# EAGLE schematic countercat_rev2 (EAGLE 6.5.0)
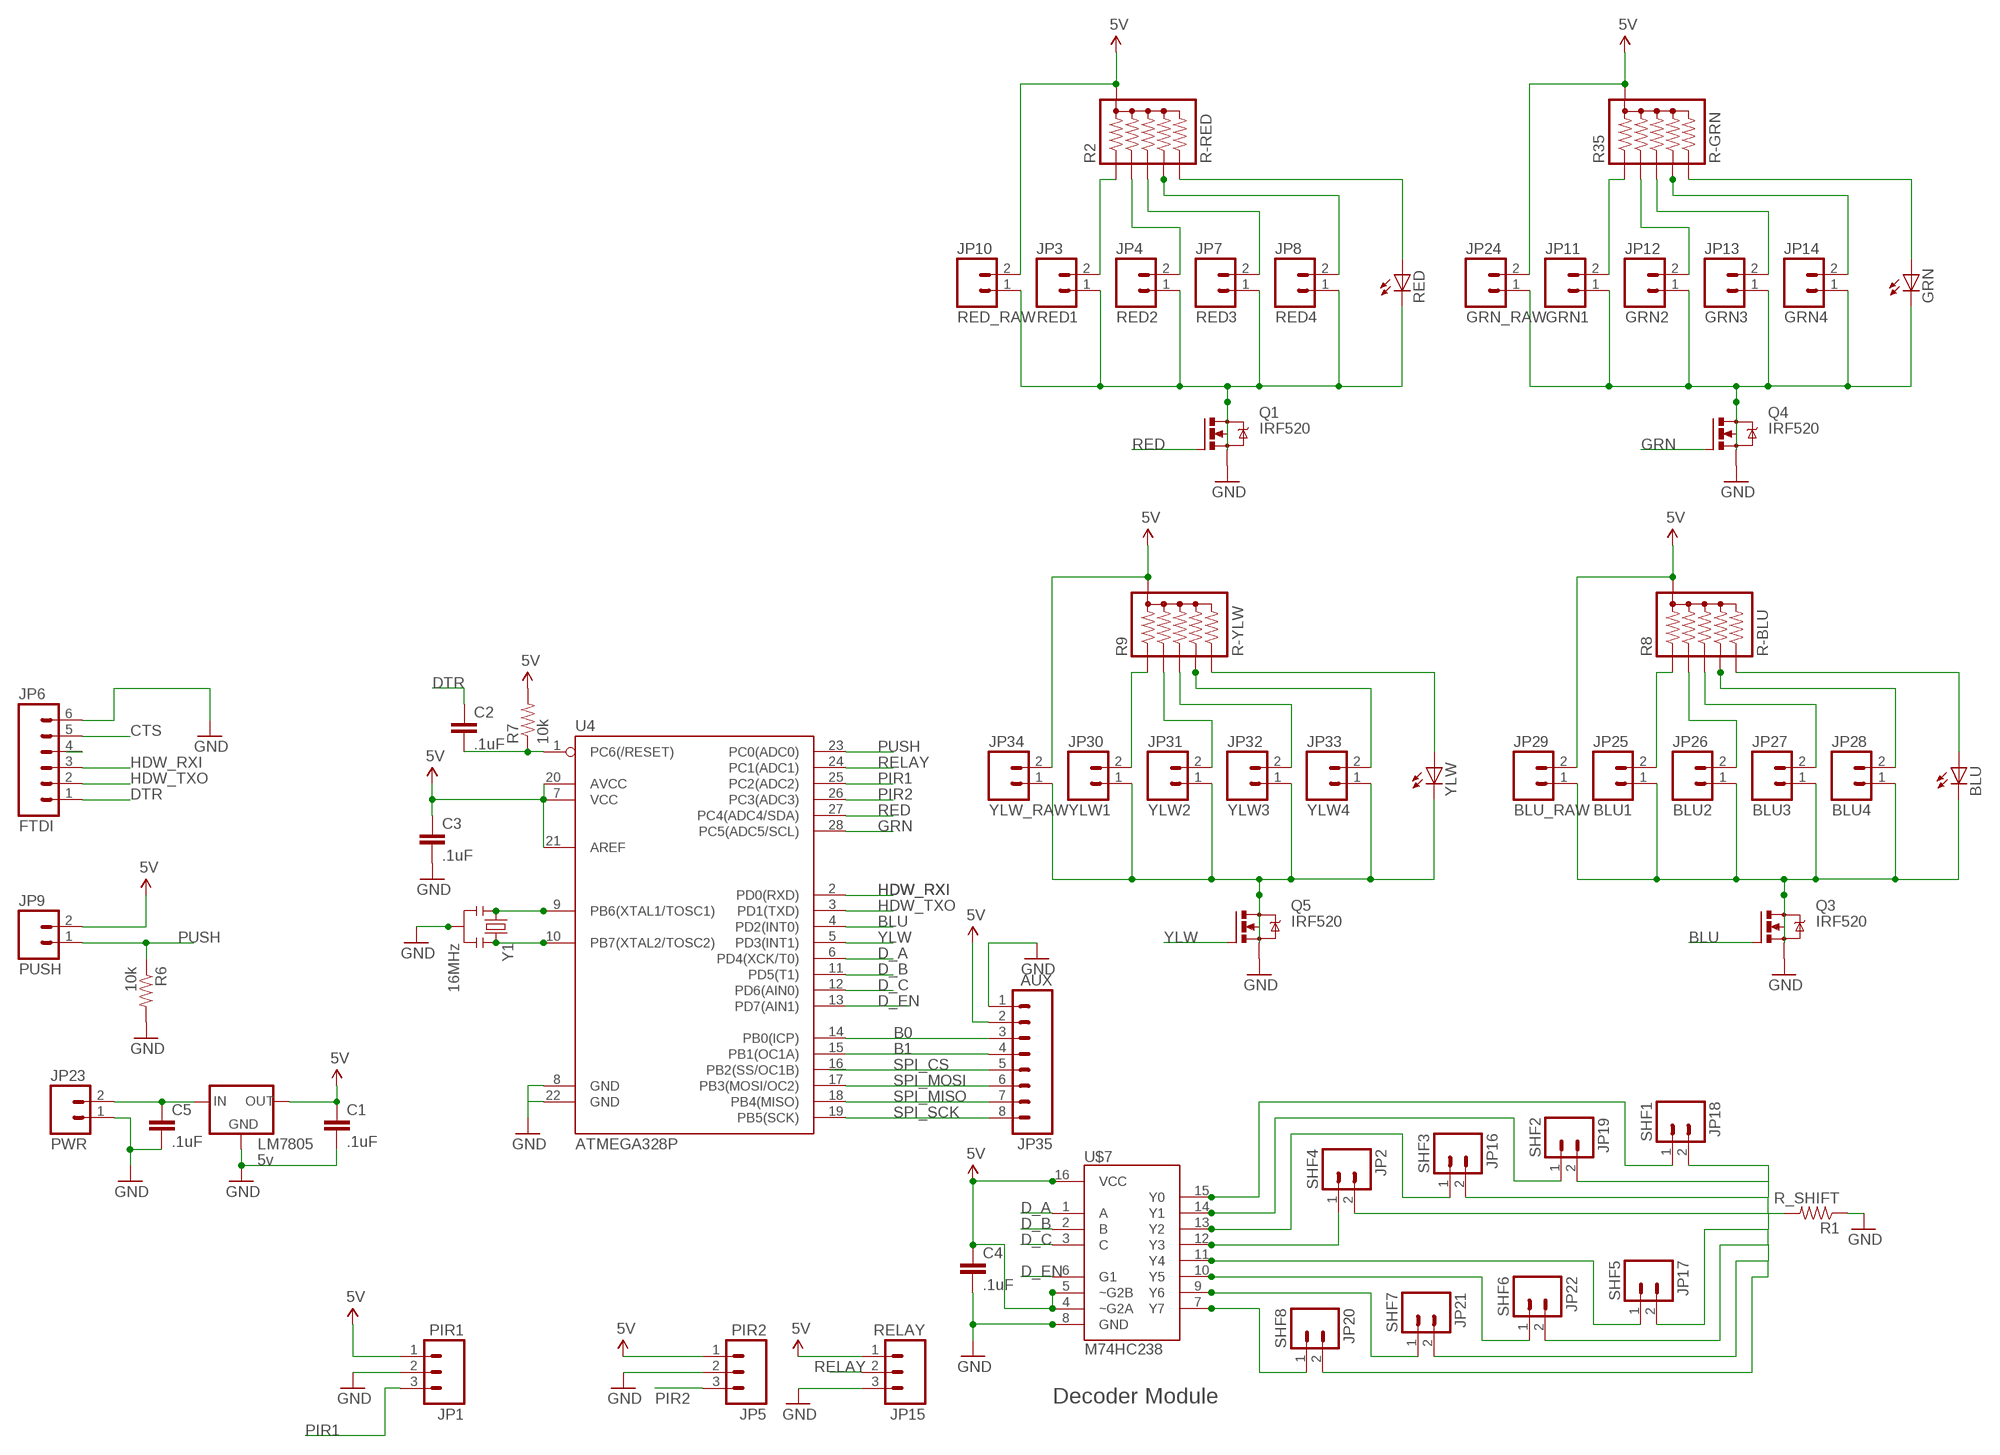
[diagram p0: schematic, sheet 1]

## Parts
BLU  LED3MM  [LED3MM]
C1  .1uF  CAPPTH2  [CAP-PTH-SMALL2]
C2  .1uF  CAPPTH2  [CAP-PTH-SMALL2]
C3  .1uF  CAPPTH2  [CAP-PTH-SMALL2]
C4  .1uF  CAPPTH2  [CAP-PTH-SMALL2]
C5  .1uF  CAPPTH2  [CAP-PTH-SMALL2]
GRN  LED3MM  [LED3MM]
JP1  PIR1  M03POLAR  [MOLEX-1X3]
JP2  SHF4  M02POLAR  [MOLEX-1X2]
JP3  RED1  M02POLAR  [MOLEX-1X2]
JP4  RED2  M02POLAR  [MOLEX-1X2]
JP5  PIR2  M03POLAR  [MOLEX-1X3]
JP6  FTDI  M06LOCK  [1X06_LOCK]
JP7  RED3  M02POLAR  [MOLEX-1X2]
JP8  RED4  M02POLAR  [MOLEX-1X2]
JP9  PUSH  M02POLAR  [MOLEX-1X2]
JP10  RED_RAW  M02POLAR  [MOLEX-1X2]
JP11  GRN1  M02POLAR  [MOLEX-1X2]
JP12  GRN2  M02POLAR  [MOLEX-1X2]
JP13  GRN3  M02POLAR  [MOLEX-1X2]
JP14  GRN4  M02POLAR  [MOLEX-1X2]
JP15  RELAY  M03POLAR  [MOLEX-1X3]
JP16  SHF3  M02POLAR  [MOLEX-1X2]
JP17  SHF5  M02POLAR  [MOLEX-1X2]
JP18  SHF1  M02POLAR  [MOLEX-1X2]
JP19  SHF2  M02POLAR  [MOLEX-1X2]
JP20  SHF8  M02POLAR  [MOLEX-1X2]
JP21  SHF7  M02POLAR  [MOLEX-1X2]
JP22  SHF6  M02POLAR  [MOLEX-1X2]
JP23  PWR  M02POLAR  [MOLEX-1X2]
JP24  GRN_RAW  M02POLAR  [MOLEX-1X2]
JP25  BLU1  M02POLAR  [MOLEX-1X2]
JP26  BLU2  M02POLAR  [MOLEX-1X2]
JP27  BLU3  M02POLAR  [MOLEX-1X2]
JP28  BLU4  M02POLAR  [MOLEX-1X2]
JP29  BLU_RAW  M02POLAR  [MOLEX-1X2]
JP30  YLW1  M02POLAR  [MOLEX-1X2]
JP31  YLW2  M02POLAR  [MOLEX-1X2]
JP32  YLW3  M02POLAR  [MOLEX-1X2]
JP33  YLW4  M02POLAR  [MOLEX-1X2]
JP34  YLW_RAW  M02POLAR  [MOLEX-1X2]
JP35  AUX  M08LOCK  [1X08_LOCK]
LM7805  5v  V_REG_78XXSINK  [TO220-IGO]
Q1  IRF520  [TO220BV]
Q3  IRF520  [TO220BV]
Q4  IRF520  [TO220BV]
Q5  IRF520  [TO220BV]
R1  R_SHIFT  RESISTORPTH-1/4W  [AXIAL-0.4]
R2  R-RED  RPACK-BUSSED-5-SIP-PTH-5  [RPACK-SIP-PTH-5]
R6  10k  RESISTORPTH-1/4W  [AXIAL-0.4]
R7  10k  RESISTORPTH-1/4W  [AXIAL-0.4]
R8  R-BLU  RPACK-BUSSED-5-SIP-PTH-5  [RPACK-SIP-PTH-5]
R9  R-YLW  RPACK-BUSSED-5-SIP-PTH-5  [RPACK-SIP-PTH-5]
R35  R-GRN  RPACK-BUSSED-5-SIP-PTH-5  [RPACK-SIP-PTH-5]
RED  LED3MM  [LED3MM]
U4  ATMEGA328P  ATMEGA328P_PDIP  [DIL28-3]
U$7  M74HC238  [DIL16]
Y1  16MHz  RESONATORPTH  [RESONATOR-PTH]
YLW  LED3MM  [LED3MM]

## Nets
5V: C1.1 C4.1 JP1.1 JP5.1 JP9.2 JP10.2 JP15.1 JP24.2 JP29.2 JP34.2 JP35.2 LM7805.OUT R2.P$1 R7.P$2 R8.P$1 R9.P$1 R35.P$1 U$7.4(~G2A) U$7.5(~G2B) U$7.16(VCC)
B0: JP35.3 U4.14(PB0(ICP))
B1: JP35.4 U4.15(PB1(OC1A))
BLU: Q3.G U4.4(PD2(INT0))
CTS: JP6.5
D_A: U4.6(PD4(XCK/T0)) U$7.1(A)
D_B: U4.11(PD5(T1)) U$7.2(B)
D_C: U4.12(PD6(AIN0)) U$7.3(C)
D_EN: U4.13(PD7(AIN1)) U$7.6(G1)
DTR: C2.1 C2.2 JP6.1 R7.P$1 U4.1(PC6(/RESET))
GND: C1.2 C3.2 C4.2 C5.2 JP1.2 JP5.2 JP6.6 JP15.3 JP23.1 JP35.1 LM7805.GND Q1.S Q3.S Q4.S Q5.S R1.P$1 R6.P$2 U4.8(GND) U4.22(GND) U$7.8(GND) Y1.2
GRN: Q4.G U4.28(PC5(ADC5/SCL))
HDW_RXI: JP6.3 U4.2(PD0(RXD))
HDW_TXO: JP6.2 U4.3(PD1(TXD))
N$1: JP17.1 U$7.11(Y4)
N$2: JP3.1 JP4.1 JP7.1 JP8.1 JP10.1 Q1.D RED.K(C)
N$3: U4.9(PB6(XTAL1/TOSC1)) Y1.1
N$4: GRN.K(C) JP11.1 JP12.1 JP13.1 JP14.1 JP24.1 Q4.D
N$5: JP11.2 R35.P$2
N$7: U4.10(PB7(XTAL2/TOSC2)) Y1.3
N$8: C3.1 U4.7(VCC) U4.20(AVCC) U4.21(AREF)
N$12: JP4.2 R2.P$3
N$13: JP12.2 R35.P$3
N$15: JP13.2 R35.P$4
N$16: JP14.2 R35.P$5
N$18: JP7.2 R2.P$4
N$19: JP8.2 R2.P$5
N$21: R2.P$6 RED.A
N$22: JP3.2 R2.P$2
N$25: JP2.2 JP16.2 JP17.2 JP18.2 JP19.2 JP20.2 JP21.2 JP22.2 R1.P$2
N$26: JP18.1 U$7.15(Y0)
N$27: JP19.1 U$7.14(Y1)
N$28: JP16.1 U$7.13(Y2)
N$29: JP2.1 U$7.12(Y3)
N$30: JP21.1 U$7.9(Y6)
N$31: JP22.1 U$7.10(Y5)
N$32: JP20.1 U$7.7(Y7)
N$33: JP6.4
N$34: BLU.K(C) JP25.1 JP26.1 JP27.1 JP28.1 JP29.1 Q3.D
N$35: JP26.2 R8.P$3
N$36: JP27.2 R8.P$4
N$37: JP28.2 R8.P$5
N$38: BLU.A R8.P$6
N$39: JP25.2 R8.P$2
N$40: JP30.1 JP31.1 JP32.1 JP33.1 JP34.1 Q5.D YLW.K(C)
N$41: JP31.2 R9.P$3
N$42: JP32.2 R9.P$4
N$43: JP33.2 R9.P$5
N$44: R9.P$6 YLW.A
N$45: GRN.A R35.P$6
N$46: JP30.2 R9.P$2
PIR1: JP1.3 U4.25(PC2(ADC2))
PIR2: JP5.3 U4.26(PC3(ADC3))
PUSH: JP9.1 R6.P$1 U4.23(PC0(ADC0))
RED: Q1.G U4.27(PC4(ADC4/SDA))
RELAY: JP15.2 U4.24(PC1(ADC1))
SPI_CS: JP35.5 U4.16(PB2(SS/OC1B))
SPI_MISO: JP35.7 U4.18(PB4(MISO))
SPI_MOSI: JP35.6 U4.17(PB3(MOSI/OC2))
SPI_SCK: JP35.8 U4.19(PB5(SCK))
VB: C5.1 JP23.2 LM7805.IN
YLW: Q5.G U4.5(PD3(INT1))

## Notes on the sheet
- Decoder Module

## Library data of the parts
BLU GRN RED YLW = SparkFun-LED:LED: LEDs Standard schematic elements and footprints for 5mm, 3mm, 1206, and 0603 sized LEDs. 5mm - Spark Fun Electronics SKU : COM-00529 (and others)
C1-C5 = SparkFun-Capacitors:CAP: Capacitor Standard 0603 ceramic capacitor, and 0.1" leaded capacitor.
JP1 JP5 JP15 = SparkFun:M03: Header 3 Standard 3-pin 0.1" header. Use with straight break away headers (SKU : PRT-00116), right angle break away headers (PRT-00553), swiss pins (PRT-00743), machine pins (PRT-00117), and female headers (PRT-00115). Molex polarized connector foot print use with SKU : PRT-08232 with associated crimp pins and housings.
JP2-JP4 JP7-JP14 JP16-JP34 = SparkFun:M02: Header 2 Standard 2-pin 0.1" header. Use with straight break away headers (SKU : PRT-00116), right angle break away headers (PRT-00553), swiss pins (PRT-00743), machine pins (PRT-00117), and female headers (PRT-00115). Molex polarized connector foot print use with SKU : PRT-08233 with associated crimp pins and housings.
JP6 = NickDC2011Breakouts:M06: Header 6 Standard 6-pin 0.1" header. Use with straight break away headers (SKU : PRT-00116), right angle break away headers (PRT-00553), swiss pins (PRT-00743), machine pins (PRT-00117), and female headers (PRT-00115). Molex polarized connector foot print use with SKU : PRT-08094 with associated crimp pins and housings. NOTES ON THE VARIANTS LOCK and LOCK_LONGPADS... This footprint was designed to help hold the alignment of a through-hole component (i.e. 6-pin header) while soldering it into place. You may notice that each hole has been shifted either up or down by 0.005 of an inch from it's more standard position (which is a perfectly straight line). This slight alteration caused the pins (the squares in the middle) to touch the edges of the holes. Because they are alternating, it causes a "brace" to hold the component in place. 0.005 has proven to be the perfect amount of "off-center" position when using our standard breakaway headers. Although looks a little odd when you look at the bare footprint, once you have a header in there, the alteration is very hard to notice. Also, if you push a header all the way into place, it is covered up entirely on the bottom side. This idea of altering the position of holes to aid alignment will be further integrated into the Sparkfun Library for other footprints. It can help hold any component with 3 or more connection pins.
JP35 = SparkFun-Connectors:M08: Header 8 Standard 8-pin 0.1" header. Use with straight break away headers (SKU : PRT-00116), right angle break away headers (PRT-00553), swiss pins (PRT-00743), machine pins (PRT-00117), and female headers (PRT-00115).
LM7805 = SparkFun-PowerIC:V_REG_78XX: Voltage Regulator Standard 7805 5V regulator. IGO (Input Ground Output). Spark Fun Electronics SKU : COM-00107
Q1 Q3-Q5 = transistor-power:IRF520: HEXFET Power MOSFET
R1 R6 R7 = SparkFun-Resistors:RESISTOR: Resistor Basic schematic elements and footprints for 0603, 1206, and PTH resistors.
R2 R8 R9 R35 = SparkFun-Resistors:RPACK-BUSSED-5: BOURNS 4600X series thick-film SIP resistor packs Five resistors bussed to a single pin (denoted by dot). 0.2W / resistor datasheet <http://dlnmh9ip6v2uc.cloudfront.net/datasheets/Components/General/4600x.pdf> SFE parts COM-10855 (330), COM-10856 (10K)
U4 = SparkFun-DigitalIC:ATMEGA328P_PDIP: uC used in the Arduino 32kb flash, 1k EEPROM, 2k SRAM This is the through-hole version of this chip.
U$7 = SparkFun-DigitalIC:M74HC238: M74HC238 - CMOS 3 TO 8 LINE DECODER
Y1 = SparkFun-FreqCtrl:RESONATOR: Resonator Small SMD resonator. Used, eg, on the Arduino Pro/ Pro Mini boards. 8MHz- XTAL-08895 16MHz- XTAL-08900